# Altium project LimeSDR-X3_1v2.PrjPcb (part 16 of 16)
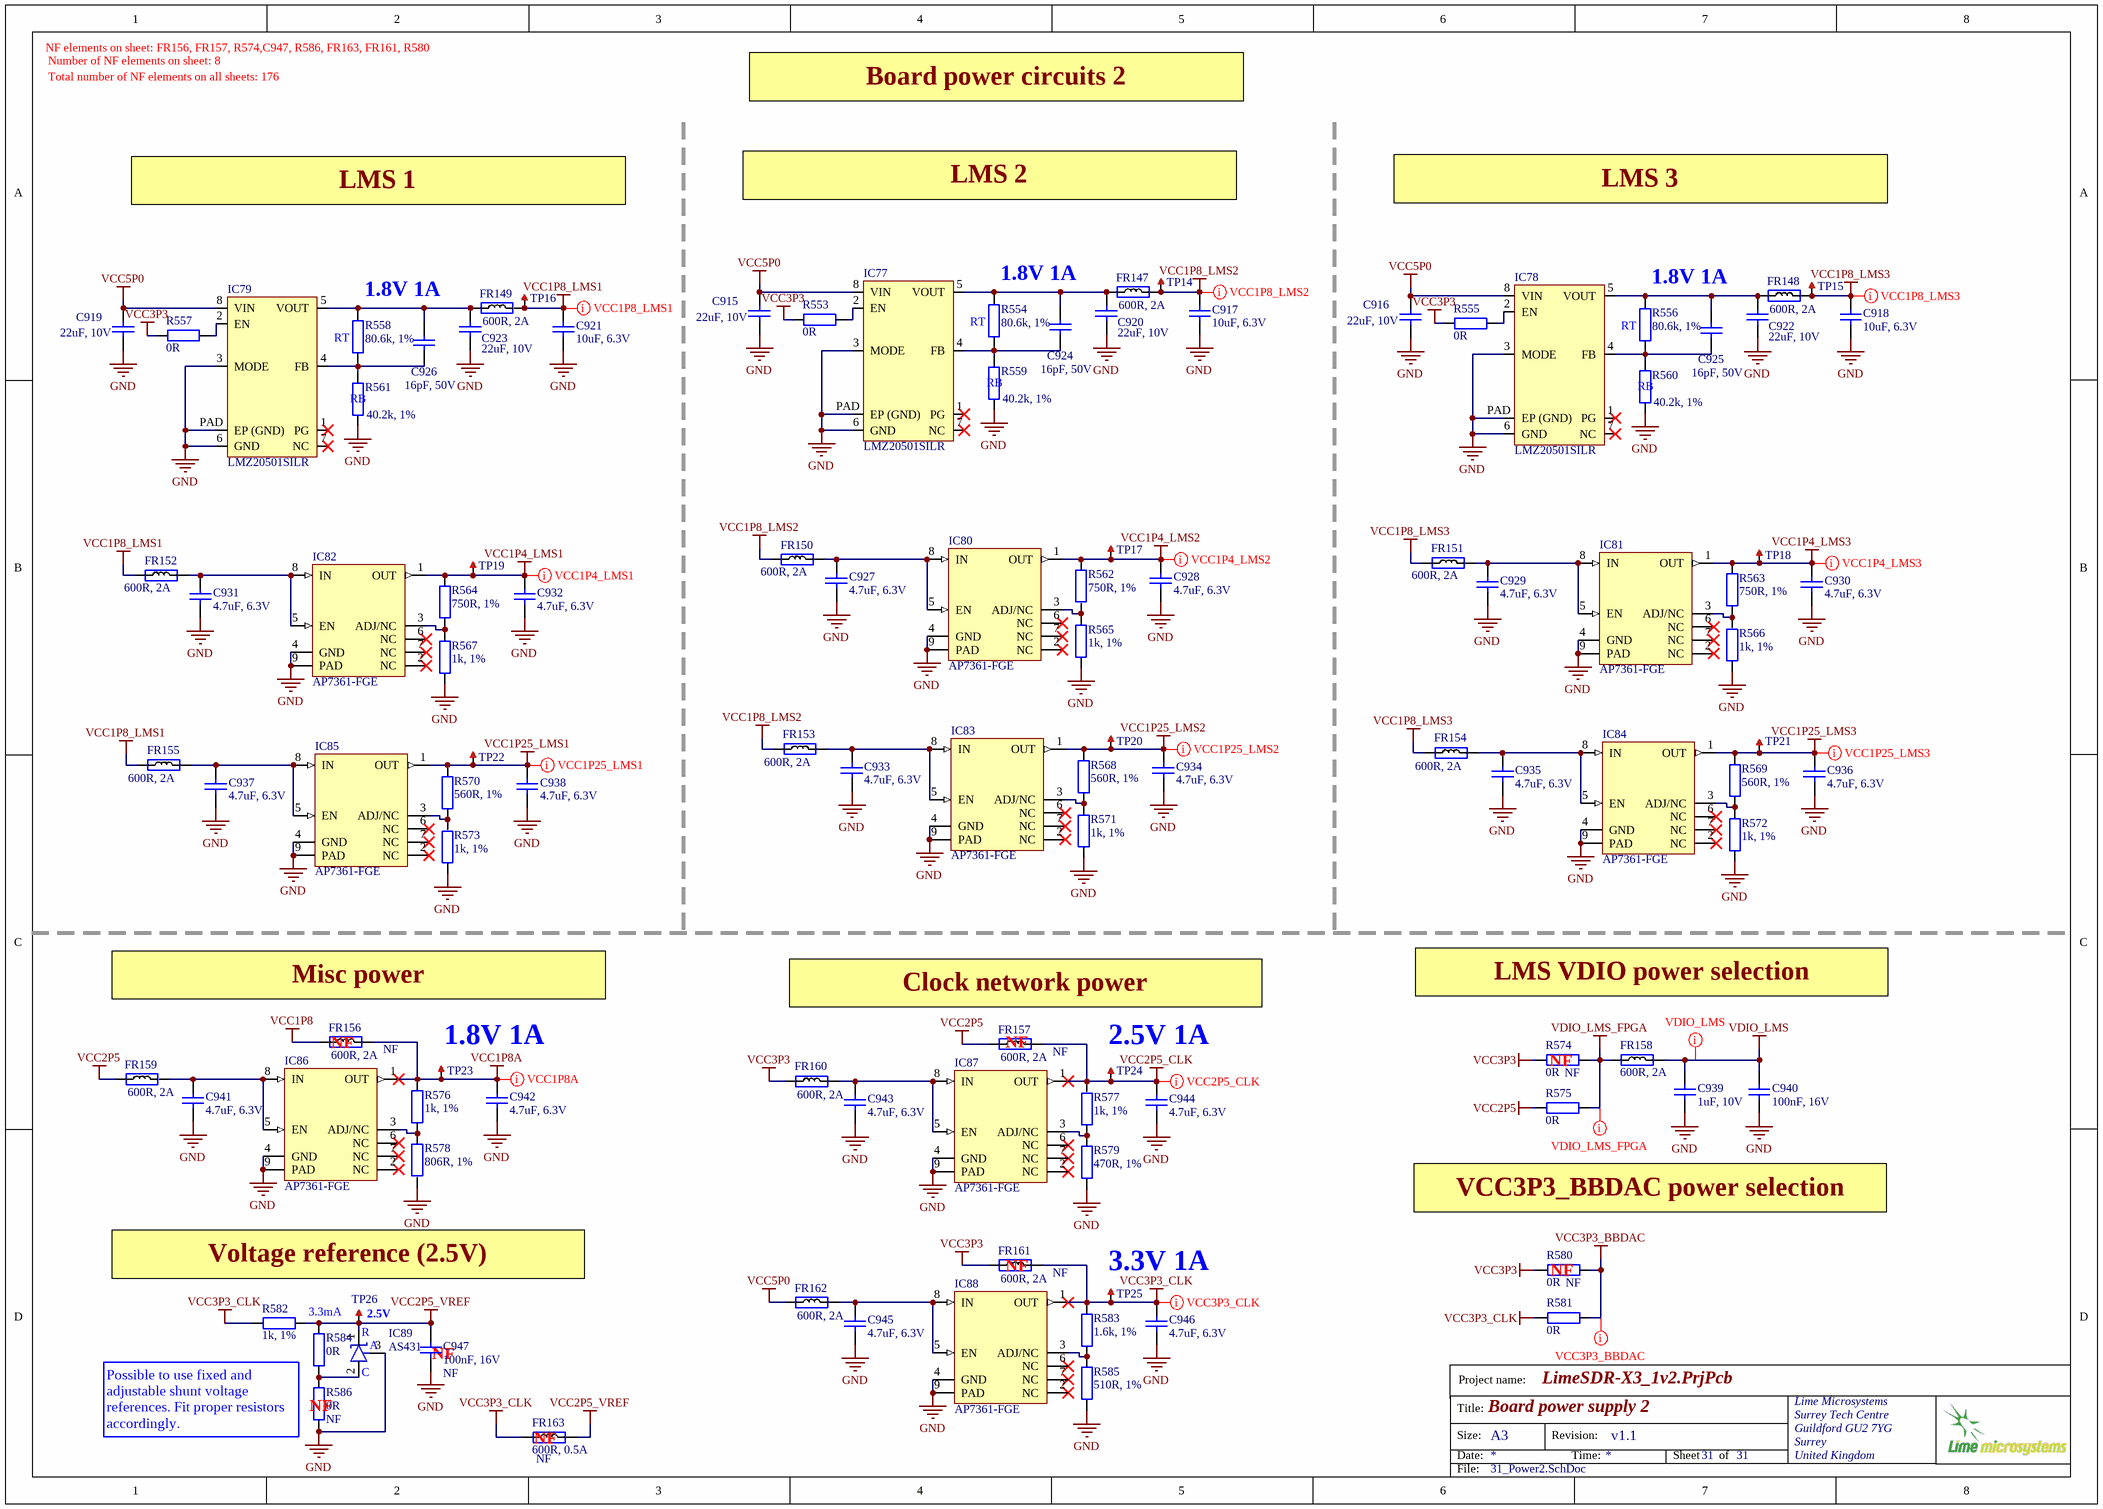
[diagram p19: 31_Power2.SchDoc]

## Nets that join several sheets
FPGA_MGTAVTT: 19_FPGA_misc (R163.2 R166.2), 20_FPGA_Power (26 pins)
GND: 07_LMS3_Misc (11 pins), 08_LMS1_RF (76 pins), 10_LMS3_RF (57 pins), 11_LMS1_Power (84 pins), 12_LMS2_Power (84 pins), 14_LMS1_RF_PA (92 pins), 15_LMS2_RF1_Misc (69 pins), 16_LMS2_RF2_Misc (69 pins), 17_FPGA_B12_B13_B14_B15 (IC39.L19 IC39.V24 IC39.W18), 19_FPGA_misc (53 pins), 20_FPGA_Power (244 pins), 21_Peripherals (52 pins), 22_LMS2_TX_BB_DACs (86 pins), 23_LMS2_RX1_BB_ADC (44 pins), 26_LMS3_RX2_BB_ADC (44 pins), 28_Clocks1 (76 pins), 29_Clocks2 (76 pins), 31_Power2 (71 pins)
GND_ADC: 19_FPGA_misc (IC39.N11 IC39.P11 IC39.P12), 20_FPGA_Power (C500.1 C501.2 FR103.2 IC39.M11)
VCC1P4_LMS1: 11_LMS1_Power (7 pins), 31_Power2 (C932.2 IC82.1 R564.1 TP19.1)
VCC1P4_LMS2: 12_LMS2_Power (7 pins), 31_Power2 (C928.2 IC80.1 R562.1 TP17.1)
VCC1P8: 20_FPGA_Power (14 pins), 29_Clocks2 (R484.2), 31_Power2 (FR156.1)
VCC1P8_LMS1: 08_LMS1_RF (24 pins), 11_LMS1_Power (11 pins), 31_Power2 (5 pins)
VCC1P8_LMS2: 12_LMS2_Power (11 pins), 31_Power2 (5 pins)
VCC1P8_LMS3: 10_LMS3_RF (18 pins), 31_Power2 (5 pins)
VCC1P8A: 21_Peripherals (C516.1 IC47.6), 22_LMS2_TX_BB_DACs (8 pins), 23_LMS2_RX1_BB_ADC (FR116.1 FR117.1), 26_LMS3_RX2_BB_ADC (FR125.1 FR126.1), 29_Clocks2 (R483.1), 31_Power2 (5 pins)
VCC1P25_LMS1: 11_LMS1_Power (18 pins), 31_Power2 (C938.2 IC85.1 R570.2 TP22.1)
VCC1P25_LMS2: 12_LMS2_Power (18 pins), 31_Power2 (C934.2 IC83.1 R568.2 TP20.1)
VCC2P5: 20_FPGA_Power (84 pins), 21_Peripherals (7 pins), 28_Clocks1 (R438.2), 31_Power2 (FR157.1 FR159.1 R575.2)
VCC2P5_CLK: 28_Clocks1 (R436.1 R467.2), 29_Clocks2 (26 pins), 31_Power2 (5 pins)
VCC2P5_VREF: 14_LMS1_RF_PA (R115.2 R130.2), 28_Clocks1 (R463.1), 31_Power2 (6 pins)
VCC3P3: 19_FPGA_misc (18 pins), 20_FPGA_Power (20 pins), 21_Peripherals (17 pins), 23_LMS2_RX1_BB_ADC (R303.2), 26_LMS3_RX2_BB_ADC (R387.2), 29_Clocks2 (C831.2 IC68.1), 31_Power2 (7 pins)
VCC3P3_BBDAC: 22_LMS2_TX_BB_DACs (12 pins), 31_Power2 (R580.1 R581.1)
VCC3P3_CLK: 21_Peripherals (FR104.1), 28_Clocks1 (11 pins), 29_Clocks2 (6 pins), 31_Power2 (8 pins)
VCC3P3_RF: 08_LMS1_RF (8 pins), 10_LMS3_RF (C80.2 C81.2 IC11.12 IC12.12), 14_LMS1_RF_PA (R116.2 R131.2), 15_LMS2_RF1_Misc (8 pins), 16_LMS2_RF2_Misc (8 pins)
VCC5P0: 21_Peripherals (R219.1 R224.2 R241.1), 23_LMS2_RX1_BB_ADC (R304.2), 26_LMS3_RX2_BB_ADC (R388.2), 29_Clocks2 (R488.1), 31_Power2 (7 pins)
VCC5P0_RF1: 14_LMS1_RF_PA (8 pins), 15_LMS2_RF1_Misc (R146.1)
VDIO_LMS: 07_LMS3_Misc (9 pins), 11_LMS1_Power (6 pins), 12_LMS2_Power (6 pins), 31_Power2 (C939.2 C940.1 FR158.2)
VDIO_LMS_FPGA: 20_FPGA_Power (14 pins), 31_Power2 (FR158.1 R574.1 R575.1)
ADF_MUXOUT: 17_FPGA_B12_B13_B14_B15 (IC39.M19), 28_Clocks1 (IC64.15 R454.1)
BOM_VER0: 18_FPGA_B16_B33_B34_B35 (IC39.K2), 19_FPGA_misc (R194.1)
BOM_VER1: 17_FPGA_B12_B13_B14_B15 (IC39.Y23), 19_FPGA_misc (R195.1)
BOM_VER2: 17_FPGA_B12_B13_B14_B15 (IC39.W24), 19_FPGA_misc (R196.1)
BOM_VER3: 18_FPGA_B16_B33_B34_B35 (IC39.N8), 19_FPGA_misc (R197.1)
CDCM_LMS2_BB_DAC1_REFC_N: 18_FPGA_B16_B33_B34_B35 (IC39.N2), 29_Clocks2 (IC67.15)
CDCM_LMS2_BB_DAC1_REFC_P: 18_FPGA_B16_B33_B34_B35 (IC39.N3), 29_Clocks2 (IC67.14)
CDCM_LMS2_BB_DAC2_REFC_N: 18_FPGA_B16_B33_B34_B35 (IC39.F5), 29_Clocks2 (IC67.16)
CDCM_LMS2_BB_DAC2_REFC_P: 18_FPGA_B16_B33_B34_B35 (IC39.G5), 29_Clocks2 (IC67.17)
CDCM_PRI_REF: 28_Clocks1 (IC62.8), 29_Clocks2 (IC67.8)
CDCM_RESET_N: 17_FPGA_B12_B13_B14_B15 (IC39.AC18), 29_Clocks2 (C806.2 IC67.44 R482.1)
CDCM_STATUS0: 17_FPGA_B12_B13_B14_B15 (IC39.AB16), 29_Clocks2 (IC67.46)
CDCM_STATUS1: 17_FPGA_B12_B13_B14_B15 (IC39.AC16), 29_Clocks2 (IC67.45)
CDCM_SYNCN: 17_FPGA_B12_B13_B14_B15 (IC39.AA15), 29_Clocks2 (IC67.42)
CLK100_FPGA_N: 17_FPGA_B12_B13_B14_B15 (IC39.V21), 29_Clocks2 (XO8.5)
CLK100_FPGA_P: 17_FPGA_B12_B13_B14_B15 (IC39.U21), 29_Clocks2 (XO8.4)
EXT_CLK_IN_N: 28_Clocks1 (R428.2 R431.2), 29_Clocks2 (J30.3)
EXT_CLK_IN_P: 28_Clocks1 (R424.2), 29_Clocks2 (J30.2 R487.2)
EXT_CLK_OUT: 28_Clocks1 (IC62.18), 29_Clocks2 (R495.2 R497.2)
EXT_PPS_IN: 17_FPGA_B12_B13_B14_B15 (IC39.N21), 29_Clocks2 (J30.5)
EXT_PPS_OUT: 17_FPGA_B12_B13_B14_B15 (IC39.T22), 29_Clocks2 (J31.5)
EXT_SYNC_IN: 17_FPGA_B12_B13_B14_B15 (IC39.P20), 29_Clocks2 (J30.6)
EXT_SYNC_OUT: 17_FPGA_B12_B13_B14_B15 (IC39.M25), 29_Clocks2 (J31.6)
FAN_CTRL: 18_FPGA_B16_B33_B34_B35 (IC39.U4), 21_Peripherals (R235.2 R236.1 VT2.G)
FPGA_CFG_CS: 17_FPGA_B12_B13_B14_B15 (IC39.P18), 19_FPGA_misc (IC40.1 IC41.7 R193.2)
FPGA_CFG_D00: 17_FPGA_B12_B13_B14_B15 (IC39.R14), 19_FPGA_misc (R185.2)
FPGA_CFG_D01: 17_FPGA_B12_B13_B14_B15 (IC39.R15), 19_FPGA_misc (R187.2)
FPGA_CFG_D02: 17_FPGA_B12_B13_B14_B15 (IC39.P14), 19_FPGA_misc (R189.2)
FPGA_CFG_D03: 17_FPGA_B12_B13_B14_B15 (IC39.N14), 19_FPGA_misc (R191.2)
FPGA_I2C_SCL: 17_FPGA_B12_B13_B14_B15 (IC39.N16), 21_Peripherals (5 pins)
FPGA_I2C_SDA: 17_FPGA_B12_B13_B14_B15 (IC39.N17), 21_Peripherals (5 pins)
FPGA_LED1_G: 17_FPGA_B12_B13_B14_B15 (IC39.T20), 21_Peripherals (R207.2)
FPGA_LED1_R: 17_FPGA_B12_B13_B14_B15 (IC39.U17), 21_Peripherals (R212.2)
FPGA_LED2_G: 17_FPGA_B12_B13_B14_B15 (IC39.U16), 21_Peripherals (R217.2)
FPGA_LED2_R: 17_FPGA_B12_B13_B14_B15 (IC39.V17), 21_Peripherals (R220.2)
FPGA_LED3_G: 17_FPGA_B12_B13_B14_B15 (IC39.U15), 21_Peripherals (R221.2)
FPGA_LED3_R: 17_FPGA_B12_B13_B14_B15 (IC39.V16), 21_Peripherals (R222.2)
FPGA_LED4_G: 17_FPGA_B12_B13_B14_B15 (IC39.U14), 21_Peripherals (R226.2)
FPGA_LED4_R: 17_FPGA_B12_B13_B14_B15 (IC39.V14), 21_Peripherals (R229.2)
FPGA_LMS2_BB_ADC1_RESET: 18_FPGA_B16_B33_B34_B35 (IC39.D23), 23_LMS2_RX1_BB_ADC (IC50.12)
FPGA_LMS2_BB_DAC1_CLK_N: 18_FPGA_B16_B33_B34_B35 (IC39.L2), 29_Clocks2 (R490.1)
FPGA_LMS2_BB_DAC1_CLK_P: 18_FPGA_B16_B33_B34_B35 (IC39.M2), 29_Clocks2 (R486.1)
FPGA_LMS2_BB_DAC2_CLK_N: 18_FPGA_B16_B33_B34_B35 (IC39.D5), 29_Clocks2 (R502.1)
FPGA_LMS2_BB_DAC2_CLK_P: 18_FPGA_B16_B33_B34_B35 (IC39.E5), 29_Clocks2 (R494.1)
FPGA_LMS3_BB_ADC2_RESET: 18_FPGA_B16_B33_B34_B35 (IC39.D20), 26_LMS3_RX2_BB_ADC (IC56.12)
FPGA_SPI0_LMS3_MISO: 07_LMS3_Misc (R68.2), 18_FPGA_B16_B33_B34_B35 (IC39.AD3)
FPGA_SPI0_LMS3_SS: 07_LMS3_Misc (R69.2), 18_FPGA_B16_B33_B34_B35 (IC39.AC2)
FPGA_SPI0_MOSI: 07_LMS3_Misc (R67.2), 18_FPGA_B16_B33_B34_B35 (IC39.Y5)
FPGA_SPI0_SCLK: 07_LMS3_Misc (R66.2), 18_FPGA_B16_B33_B34_B35 (IC39.Y6)
FPGA_SPI1_CDCM_SS: 17_FPGA_B12_B13_B14_B15 (IC39.AB22), 29_Clocks2 (IC67.4)
FPGA_SPI1_LMS2_BB_ADC1_SS: 18_FPGA_B16_B33_B34_B35 (IC39.C22), 23_LMS2_RX1_BB_ADC (IC50.15)
FPGA_SPI1_LMS3_BB_ADC2_SS: 18_FPGA_B16_B33_B34_B35 (IC39.E20), 26_LMS3_RX2_BB_ADC (IC56.15)
FPGA_SPI1_MISO: 17_FPGA_B12_B13_B14_B15 (IC39.L14), 29_Clocks2 (IC67.3)
FPGA_SPI1_MISO_BB_ADC: 18_FPGA_B16_B33_B34_B35 (IC39.E22), 21_Peripherals (IC47.3 R248.2)
FPGA_SPI1_MISO_BB_ADC_LS: 21_Peripherals (IC47.4 R247.2 R248.1), 23_LMS2_RX1_BB_ADC (IC50.64), 26_LMS3_RX2_BB_ADC (IC56.64)
FPGA_SPI1_MOSI: 17_FPGA_B12_B13_B14_B15 (IC39.M14), 23_LMS2_RX1_BB_ADC (IC50.14), 26_LMS3_RX2_BB_ADC (IC56.14), 29_Clocks2 (IC67.2)
FPGA_SPI1_SCLK: 17_FPGA_B12_B13_B14_B15 (IC39.M16), 23_LMS2_RX1_BB_ADC (IC50.13), 26_LMS3_RX2_BB_ADC (IC56.13), 29_Clocks2 (IC67.5)
FPGA_SPI2_ADF_SS: 18_FPGA_B16_B33_B34_B35 (IC39.J5), 28_Clocks1 (R459.1)
FPGA_SPI2_LMS1_TX1DAC_SS: 14_LMS1_RF_PA (R123.2), 17_FPGA_B12_B13_B14_B15 (IC39.AA17)
FPGA_SPI2_LMS1_TX2DAC_SS: 14_LMS1_RF_PA (R138.2), 17_FPGA_B12_B13_B14_B15 (IC39.AB17)
FPGA_SPI2_MOSI: 14_LMS1_RF_PA (R125.2 R140.2), 18_FPGA_B16_B33_B34_B35 (IC39.B2), 28_Clocks1 (R458.1 R465.2)
FPGA_SPI2_SCLK: 14_LMS1_RF_PA (R124.2 R139.2), 18_FPGA_B16_B33_B34_B35 (IC39.C2), 28_Clocks1 (R457.1 R464.2)
FPGA_SPI2_XO_DAC_SS: 18_FPGA_B16_B33_B34_B35 (IC39.J6), 28_Clocks1 (R462.2)
FPGA_SW0: 18_FPGA_B16_B33_B34_B35 (IC39.K5), 21_Peripherals (R205.2 SW1.2)
FPGA_SW1: 18_FPGA_B16_B33_B34_B35 (IC39.L5), 21_Peripherals (R204.2 SW1.4)
FPGA_SW2: 18_FPGA_B16_B33_B34_B35 (IC39.G1), 21_Peripherals (R203.2 SW1.6)
FPGA_SW3: 18_FPGA_B16_B33_B34_B35 (IC39.G2), 21_Peripherals (R202.2 SW1.8)
GNSS_TPULSE: 17_FPGA_B12_B13_B14_B15 (IC39.L20), 21_Peripherals (IC46.3)
GNSS_UART_RX: 17_FPGA_B12_B13_B14_B15 (IC39.L25), 21_Peripherals (IC46.21)
GNSS_UART_TX: 17_FPGA_B12_B13_B14_B15 (IC39.L24), 21_Peripherals (IC46.20)
LM75_OS: 17_FPGA_B12_B13_B14_B15 (IC39.U24), 21_Peripherals (IC42.3 R206.1 R235.1)
LMK1_CLK1: 17_FPGA_B12_B13_B14_B15 (IC39.W21), 28_Clocks1 (IC62.1)
LMK1_CLK2: 18_FPGA_B16_B33_B34_B35 (IC39.R3), 28_Clocks1 (IC62.3)
LMK1_SEL0: 17_FPGA_B12_B13_B14_B15 (IC39.K15), 28_Clocks1 (R427.1)
LMK2_CLK: 17_FPGA_B12_B13_B14_B15 (IC39.M21), 29_Clocks2 (IC68.3)
LMK2_CLKIN0: 28_Clocks1 (IC62.5), 29_Clocks2 (C791.2)
LMK2_CLKIN1: 18_FPGA_B16_B33_B34_B35 (IC39.P4), 29_Clocks2 (C795.2)
LMK2_SEL0: 17_FPGA_B12_B13_B14_B15 (IC39.H21), 29_Clocks2 (R477.1)
LMS1_TX1_EN: 14_LMS1_RF_PA (IC13.3), 17_FPGA_B12_B13_B14_B15 (IC39.J23)
LMS1_TX1_OUT: 08_LMS1_RF (C31.2), 14_LMS1_RF_PA (IC14.3)
LMS1_TX2_EN: 14_LMS1_RF_PA (IC18.3), 17_FPGA_B12_B13_B14_B15 (IC39.H23)
LMS1_TX2_OUT: 08_LMS1_RF (C37.2), 14_LMS1_RF_PA (IC19.3)
LMS2_BB_ADC1_CLK_N: 23_LMS2_RX1_BB_ADC (C582.2 R278.1), 29_Clocks2 (IC67.25)
LMS2_BB_ADC1_CLK_P: 23_LMS2_RX1_BB_ADC (C581.2 R278.2), 29_Clocks2 (IC67.26)
LMS2_BB_ADC1_CLKOUT_N: 18_FPGA_B16_B33_B34_B35 (IC39.C18), 23_LMS2_RX1_BB_ADC (IC50.56)
LMS2_BB_ADC1_CLKOUT_P: 18_FPGA_B16_B33_B34_B35 (IC39.D18), 23_LMS2_RX1_BB_ADC (IC50.57)
LMS2_BB_ADC1_DA0_N: 18_FPGA_B16_B33_B34_B35 (IC39.A20), 23_LMS2_RX1_BB_ADC (IC50.40)
LMS2_BB_ADC1_DA0_P: 18_FPGA_B16_B33_B34_B35 (IC39.B20), 23_LMS2_RX1_BB_ADC (IC50.41)
LMS2_BB_ADC1_DA1_N: 18_FPGA_B16_B33_B34_B35 (IC39.A18), 23_LMS2_RX1_BB_ADC (IC50.42)
LMS2_BB_ADC1_DA1_P: 18_FPGA_B16_B33_B34_B35 (IC39.A17), 23_LMS2_RX1_BB_ADC (IC50.43)
LMS2_BB_ADC1_DA2_N: 18_FPGA_B16_B33_B34_B35 (IC39.F17), 23_LMS2_RX1_BB_ADC (IC50.44)
LMS2_BB_ADC1_DA2_P: 18_FPGA_B16_B33_B34_B35 (IC39.G17), 23_LMS2_RX1_BB_ADC (IC50.45)
LMS2_BB_ADC1_DA3_N: 18_FPGA_B16_B33_B34_B35 (IC39.A19), 23_LMS2_RX1_BB_ADC (IC50.46)
LMS2_BB_ADC1_DA3_P: 18_FPGA_B16_B33_B34_B35 (IC39.B19), 23_LMS2_RX1_BB_ADC (IC50.47)
LMS2_BB_ADC1_DA4_N: 18_FPGA_B16_B33_B34_B35 (IC39.B17), 23_LMS2_RX1_BB_ADC (IC50.50)
LMS2_BB_ADC1_DA4_P: 18_FPGA_B16_B33_B34_B35 (IC39.C17), 23_LMS2_RX1_BB_ADC (IC50.51)
LMS2_BB_ADC1_DA5_N: 18_FPGA_B16_B33_B34_B35 (IC39.D16), 23_LMS2_RX1_BB_ADC (IC50.52)
LMS2_BB_ADC1_DA5_P: 18_FPGA_B16_B33_B34_B35 (IC39.E16), 23_LMS2_RX1_BB_ADC (IC50.53)
LMS2_BB_ADC1_DA6_N: 18_FPGA_B16_B33_B34_B35 (IC39.A22), 23_LMS2_RX1_BB_ADC (IC50.54)
LMS2_BB_ADC1_DA6_P: 18_FPGA_B16_B33_B34_B35 (IC39.B22), 23_LMS2_RX1_BB_ADC (IC50.55)
LMS2_BB_ADC1_DB0_N: 18_FPGA_B16_B33_B34_B35 (IC39.A24), 23_LMS2_RX1_BB_ADC (IC50.60)
LMS2_BB_ADC1_DB0_P: 18_FPGA_B16_B33_B34_B35 (IC39.A23), 23_LMS2_RX1_BB_ADC (IC50.61)
LMS2_BB_ADC1_DB1_N: 18_FPGA_B16_B33_B34_B35 (IC39.B26), 23_LMS2_RX1_BB_ADC (IC50.62)
LMS2_BB_ADC1_DB1_P: 18_FPGA_B16_B33_B34_B35 (IC39.C26), 23_LMS2_RX1_BB_ADC (IC50.63)
LMS2_BB_ADC1_DB2_N: 18_FPGA_B16_B33_B34_B35 (IC39.F19), 23_LMS2_RX1_BB_ADC (IC50.2)
LMS2_BB_ADC1_DB2_P: 18_FPGA_B16_B33_B34_B35 (IC39.F18), 23_LMS2_RX1_BB_ADC (IC50.3)
LMS2_BB_ADC1_DB3_N: 18_FPGA_B16_B33_B34_B35 (IC39.B21), 23_LMS2_RX1_BB_ADC (IC50.4)
LMS2_BB_ADC1_DB3_P: 18_FPGA_B16_B33_B34_B35 (IC39.C21), 23_LMS2_RX1_BB_ADC (IC50.5)
LMS2_BB_ADC1_DB4_N: 18_FPGA_B16_B33_B34_B35 (IC39.D21), 23_LMS2_RX1_BB_ADC (IC50.6)
LMS2_BB_ADC1_DB4_P: 18_FPGA_B16_B33_B34_B35 (IC39.E21), 23_LMS2_RX1_BB_ADC (IC50.7)
LMS2_BB_ADC1_DB5_N: 18_FPGA_B16_B33_B34_B35 (IC39.B24), 23_LMS2_RX1_BB_ADC (IC50.8)
LMS2_BB_ADC1_DB5_P: 18_FPGA_B16_B33_B34_B35 (IC39.C24), 23_LMS2_RX1_BB_ADC (IC50.9)
LMS2_BB_ADC1_DB6_N: 18_FPGA_B16_B33_B34_B35 (IC39.A25), 23_LMS2_RX1_BB_ADC (IC50.10)
LMS2_BB_ADC1_DB6_P: 18_FPGA_B16_B33_B34_B35 (IC39.B25), 23_LMS2_RX1_BB_ADC (IC50.11)
LMS2_BB_DAC1_B0_N: 18_FPGA_B16_B33_B34_B35 (IC39.M1), 22_LMS2_TX_BB_DACs (IC48.9)
LMS2_BB_DAC1_B0_P: 18_FPGA_B16_B33_B34_B35 (IC39.N1), 22_LMS2_TX_BB_DACs (IC48.8)
LMS2_BB_DAC1_B1_N: 18_FPGA_B16_B33_B34_B35 (IC39.R6), 22_LMS2_TX_BB_DACs (IC48.7)
LMS2_BB_DAC1_B1_P: 18_FPGA_B16_B33_B34_B35 (IC39.R7), 22_LMS2_TX_BB_DACs (IC48.6)
LMS2_BB_DAC1_B2_N: 18_FPGA_B16_B33_B34_B35 (IC39.L7), 22_LMS2_TX_BB_DACs (IC48.5)
LMS2_BB_DAC1_B2_P: 18_FPGA_B16_B33_B34_B35 (IC39.M7), 22_LMS2_TX_BB_DACs (IC48.4)
LMS2_BB_DAC1_B3_N: 18_FPGA_B16_B33_B34_B35 (IC39.T7), 22_LMS2_TX_BB_DACs (IC48.3)
LMS2_BB_DAC1_B3_P: 18_FPGA_B16_B33_B34_B35 (IC39.T8), 22_LMS2_TX_BB_DACs (IC48.2)
LMS2_BB_DAC1_B4_N: 18_FPGA_B16_B33_B34_B35 (IC39.P8), 22_LMS2_TX_BB_DACs (IC48.1)
LMS2_BB_DAC1_B4_P: 18_FPGA_B16_B33_B34_B35 (IC39.R8), 22_LMS2_TX_BB_DACs (IC48.68)
LMS2_BB_DAC1_B5_N: 18_FPGA_B16_B33_B34_B35 (IC39.U5), 22_LMS2_TX_BB_DACs (IC48.67)
LMS2_BB_DAC1_B5_P: 18_FPGA_B16_B33_B34_B35 (IC39.U6), 22_LMS2_TX_BB_DACs (IC48.66)
LMS2_BB_DAC1_B6_N: 18_FPGA_B16_B33_B34_B35 (IC39.P5), 22_LMS2_TX_BB_DACs (IC48.65)
LMS2_BB_DAC1_B6_P: 18_FPGA_B16_B33_B34_B35 (IC39.P6), 22_LMS2_TX_BB_DACs (IC48.64)
LMS2_BB_DAC1_B7_N: 18_FPGA_B16_B33_B34_B35 (IC39.R5), 22_LMS2_TX_BB_DACs (IC48.63)
LMS2_BB_DAC1_B7_P: 18_FPGA_B16_B33_B34_B35 (IC39.T5), 22_LMS2_TX_BB_DACs (IC48.62)
LMS2_BB_DAC1_B8_N: 18_FPGA_B16_B33_B34_B35 (IC39.U1), 22_LMS2_TX_BB_DACs (IC48.60)
LMS2_BB_DAC1_B8_P: 18_FPGA_B16_B33_B34_B35 (IC39.U2), 22_LMS2_TX_BB_DACs (IC48.59)
LMS2_BB_DAC1_B9_N: 18_FPGA_B16_B33_B34_B35 (IC39.R2), 22_LMS2_TX_BB_DACs (IC48.58)
LMS2_BB_DAC1_B9_P: 18_FPGA_B16_B33_B34_B35 (IC39.T2), 22_LMS2_TX_BB_DACs (IC48.57)
LMS2_BB_DAC1_B10_N: 18_FPGA_B16_B33_B34_B35 (IC39.P1), 22_LMS2_TX_BB_DACs (IC48.56)
LMS2_BB_DAC1_B10_P: 18_FPGA_B16_B33_B34_B35 (IC39.R1), 22_LMS2_TX_BB_DACs (IC48.55)
LMS2_BB_DAC1_B11_N: 18_FPGA_B16_B33_B34_B35 (IC39.T3), 22_LMS2_TX_BB_DACs (IC48.54)
LMS2_BB_DAC1_B11_P: 18_FPGA_B16_B33_B34_B35 (IC39.T4), 22_LMS2_TX_BB_DACs (IC48.53)
LMS2_BB_DAC1_B12_N: 18_FPGA_B16_B33_B34_B35 (IC39.L4), 22_LMS2_TX_BB_DACs (IC48.52)
LMS2_BB_DAC1_B12_P: 18_FPGA_B16_B33_B34_B35 (IC39.M4), 22_LMS2_TX_BB_DACs (IC48.51)
LMS2_BB_DAC1_B13_N: 18_FPGA_B16_B33_B34_B35 (IC39.J3), 22_LMS2_TX_BB_DACs (IC48.50)
LMS2_BB_DAC1_B13_P: 18_FPGA_B16_B33_B34_B35 (IC39.K3), 22_LMS2_TX_BB_DACs (IC48.49)
LMS2_BB_DAC1_B14_N: 18_FPGA_B16_B33_B34_B35 (IC39.J1), 22_LMS2_TX_BB_DACs (IC48.48)
LMS2_BB_DAC1_B14_P: 18_FPGA_B16_B33_B34_B35 (IC39.K1), 22_LMS2_TX_BB_DACs (IC48.47)
LMS2_BB_DAC1_B15_N: 18_FPGA_B16_B33_B34_B35 (IC39.H1), 22_LMS2_TX_BB_DACs (IC48.46)
LMS2_BB_DAC1_B15_P: 18_FPGA_B16_B33_B34_B35 (IC39.H2), 22_LMS2_TX_BB_DACs (IC48.45)
LMS2_BB_DAC1_CLK_N: 22_LMS2_TX_BB_DACs (C526.2), 29_Clocks2 (R490.2 R491.2)
LMS2_BB_DAC1_CLK_P: 22_LMS2_TX_BB_DACs (C528.2), 29_Clocks2 (R486.2 R489.2)
LMS2_BB_DAC1_PD: 17_FPGA_B12_B13_B14_B15 (IC39.M26), 22_LMS2_TX_BB_DACs (IC48.40)
LMS2_BB_DAC1_SELIQ_N: 18_FPGA_B16_B33_B34_B35 (IC39.M5), 22_LMS2_TX_BB_DACs (IC48.44)
LMS2_BB_DAC1_SELIQ_P: 18_FPGA_B16_B33_B34_B35 (IC39.M6), 22_LMS2_TX_BB_DACs (IC48.43)
LMS2_BB_DAC2_B0_N: 18_FPGA_B16_B33_B34_B35 (IC39.D6), 22_LMS2_TX_BB_DACs (IC49.9)
LMS2_BB_DAC2_B0_P: 18_FPGA_B16_B33_B34_B35 (IC39.E6), 22_LMS2_TX_BB_DACs (IC49.8)
LMS2_BB_DAC2_B1_N: 18_FPGA_B16_B33_B34_B35 (IC39.G7), 22_LMS2_TX_BB_DACs (IC49.7)
LMS2_BB_DAC2_B1_P: 18_FPGA_B16_B33_B34_B35 (IC39.H7), 22_LMS2_TX_BB_DACs (IC49.6)
LMS2_BB_DAC2_B2_N: 18_FPGA_B16_B33_B34_B35 (IC39.E3), 22_LMS2_TX_BB_DACs (IC49.5)
LMS2_BB_DAC2_B2_P: 18_FPGA_B16_B33_B34_B35 (IC39.F3), 22_LMS2_TX_BB_DACs (IC49.4)
LMS2_BB_DAC2_B3_N: 18_FPGA_B16_B33_B34_B35 (IC39.K6), 22_LMS2_TX_BB_DACs (IC49.3)
LMS2_BB_DAC2_B3_P: 18_FPGA_B16_B33_B34_B35 (IC39.K7), 22_LMS2_TX_BB_DACs (IC49.2)
LMS2_BB_DAC2_B4_N: 18_FPGA_B16_B33_B34_B35 (IC39.H4), 22_LMS2_TX_BB_DACs (IC49.1)
LMS2_BB_DAC2_B4_P: 18_FPGA_B16_B33_B34_B35 (IC39.J4), 22_LMS2_TX_BB_DACs (IC49.68)
LMS2_BB_DAC2_B5_N: 18_FPGA_B16_B33_B34_B35 (IC39.E2), 22_LMS2_TX_BB_DACs (IC49.67)
LMS2_BB_DAC2_B5_P: 18_FPGA_B16_B33_B34_B35 (IC39.F2), 22_LMS2_TX_BB_DACs (IC49.66)
LMS2_BB_DAC2_B6_N: 18_FPGA_B16_B33_B34_B35 (IC39.D1), 22_LMS2_TX_BB_DACs (IC49.65)
LMS2_BB_DAC2_B6_P: 18_FPGA_B16_B33_B34_B35 (IC39.E1), 22_LMS2_TX_BB_DACs (IC49.64)
LMS2_BB_DAC2_B7_N: 18_FPGA_B16_B33_B34_B35 (IC39.B1), 22_LMS2_TX_BB_DACs (IC49.63)
LMS2_BB_DAC2_B7_P: 18_FPGA_B16_B33_B34_B35 (IC39.C1), 22_LMS2_TX_BB_DACs (IC49.62)
LMS2_BB_DAC2_B8_N: 18_FPGA_B16_B33_B34_B35 (IC39.C3), 22_LMS2_TX_BB_DACs (IC49.60)
LMS2_BB_DAC2_B8_P: 18_FPGA_B16_B33_B34_B35 (IC39.D3), 22_LMS2_TX_BB_DACs (IC49.59)
LMS2_BB_DAC2_B9_N: 18_FPGA_B16_B33_B34_B35 (IC39.A4), 22_LMS2_TX_BB_DACs (IC49.58)
LMS2_BB_DAC2_B9_P: 18_FPGA_B16_B33_B34_B35 (IC39.B4), 22_LMS2_TX_BB_DACs (IC49.57)
LMS2_BB_DAC2_B10_N: 18_FPGA_B16_B33_B34_B35 (IC39.A2), 22_LMS2_TX_BB_DACs (IC49.56)
LMS2_BB_DAC2_B10_P: 18_FPGA_B16_B33_B34_B35 (IC39.A3), 22_LMS2_TX_BB_DACs (IC49.55)
LMS2_BB_DAC2_B11_N: 18_FPGA_B16_B33_B34_B35 (IC39.A5), 22_LMS2_TX_BB_DACs (IC49.54)
LMS2_BB_DAC2_B11_P: 18_FPGA_B16_B33_B34_B35 (IC39.B5), 22_LMS2_TX_BB_DACs (IC49.53)
LMS2_BB_DAC2_B12_N: 18_FPGA_B16_B33_B34_B35 (IC39.G6), 22_LMS2_TX_BB_DACs (IC49.52)
LMS2_BB_DAC2_B12_P: 18_FPGA_B16_B33_B34_B35 (IC39.H6), 22_LMS2_TX_BB_DACs (IC49.51)
LMS2_BB_DAC2_B13_N: 18_FPGA_B16_B33_B34_B35 (IC39.F7), 22_LMS2_TX_BB_DACs (IC49.50)
LMS2_BB_DAC2_B13_P: 18_FPGA_B16_B33_B34_B35 (IC39.F8), 22_LMS2_TX_BB_DACs (IC49.49)
LMS2_BB_DAC2_B14_N: 18_FPGA_B16_B33_B34_B35 (IC39.G9), 22_LMS2_TX_BB_DACs (IC49.48)
LMS2_BB_DAC2_B14_P: 18_FPGA_B16_B33_B34_B35 (IC39.H9), 22_LMS2_TX_BB_DACs (IC49.47)
LMS2_BB_DAC2_B15_N: 18_FPGA_B16_B33_B34_B35 (IC39.G8), 22_LMS2_TX_BB_DACs (IC49.46)
LMS2_BB_DAC2_B15_P: 18_FPGA_B16_B33_B34_B35 (IC39.H8), 22_LMS2_TX_BB_DACs (IC49.45)
LMS2_BB_DAC2_CLK_N: 22_LMS2_TX_BB_DACs (C527.2), 29_Clocks2 (R502.2 R503.2)
LMS2_BB_DAC2_CLK_P: 22_LMS2_TX_BB_DACs (C529.2), 29_Clocks2 (R494.2 R498.2)
LMS2_BB_DAC2_PD: 17_FPGA_B12_B13_B14_B15 (IC39.N24), 22_LMS2_TX_BB_DACs (IC49.40)
LMS2_BB_DAC2_SELIQ_N: 18_FPGA_B16_B33_B34_B35 (IC39.K8), 22_LMS2_TX_BB_DACs (IC49.44)
LMS2_BB_DAC2_SELIQ_P: 18_FPGA_B16_B33_B34_B35 (IC39.L8), 22_LMS2_TX_BB_DACs (IC49.43)
LMS2_RX1_LNA_SD: 15_LMS2_RF1_Misc (IC29.6 R149.2), 17_FPGA_B12_B13_B14_B15 (IC39.AD23)
LMS2_RX2_LNA_SD: 16_LMS2_RF2_Misc (IC37.6 R160.2), 17_FPGA_B12_B13_B14_B15 (IC39.AD24)
LMS2_TX1_1_CPL_OUT: 10_LMS3_RF (C76.2), 15_LMS2_RF1_Misc (IC26.2)
LMS2_TX1_1_EN: 15_LMS2_RF1_Misc (IC27.3), 17_FPGA_B12_B13_B14_B15 (IC39.L15)
LMS2_TX2_1_CPL_OUT: 10_LMS3_RF (C77.2), 16_LMS2_RF2_Misc (IC34.2)
LMS2_TX2_1_EN: 16_LMS2_RF2_Misc (IC35.3), 18_FPGA_B16_B33_B34_B35 (IC39.H14)
LMS3_BB_ADC2_CLK_N: 26_LMS3_RX2_BB_ADC (C672.2 R362.1), 29_Clocks2 (IC67.36)
LMS3_BB_ADC2_CLK_P: 26_LMS3_RX2_BB_ADC (C671.2 R362.2), 29_Clocks2 (IC67.35)
LMS3_BB_ADC2_CLKOUT_N: 17_FPGA_B12_B13_B14_B15 (IC39.V22), 26_LMS3_RX2_BB_ADC (IC56.56)
LMS3_BB_ADC2_CLKOUT_P: 17_FPGA_B12_B13_B14_B15 (IC39.U22), 26_LMS3_RX2_BB_ADC (IC56.57)
LMS3_BB_ADC2_DA0_N: 17_FPGA_B12_B13_B14_B15 (IC39.T15), 26_LMS3_RX2_BB_ADC (IC56.40)
LMS3_BB_ADC2_DA0_P: 17_FPGA_B12_B13_B14_B15 (IC39.T14), 26_LMS3_RX2_BB_ADC (IC56.41)
LMS3_BB_ADC2_DA1_N: 17_FPGA_B12_B13_B14_B15 (IC39.T18), 26_LMS3_RX2_BB_ADC (IC56.42)
LMS3_BB_ADC2_DA1_P: 17_FPGA_B12_B13_B14_B15 (IC39.T17), 26_LMS3_RX2_BB_ADC (IC56.43)
LMS3_BB_ADC2_DA2_N: 17_FPGA_B12_B13_B14_B15 (IC39.W23), 26_LMS3_RX2_BB_ADC (IC56.44)
LMS3_BB_ADC2_DA2_P: 17_FPGA_B12_B13_B14_B15 (IC39.V23), 26_LMS3_RX2_BB_ADC (IC56.45)
LMS3_BB_ADC2_DA3_N: 17_FPGA_B12_B13_B14_B15 (IC39.U19), 26_LMS3_RX2_BB_ADC (IC56.46)
LMS3_BB_ADC2_DA3_P: 17_FPGA_B12_B13_B14_B15 (IC39.T19), 26_LMS3_RX2_BB_ADC (IC56.47)
LMS3_BB_ADC2_DA4_N: 17_FPGA_B12_B13_B14_B15 (IC39.AA23), 26_LMS3_RX2_BB_ADC (IC56.50)
LMS3_BB_ADC2_DA4_P: 17_FPGA_B12_B13_B14_B15 (IC39.AA22), 26_LMS3_RX2_BB_ADC (IC56.51)
LMS3_BB_ADC2_DA5_N: 17_FPGA_B12_B13_B14_B15 (IC39.U26), 26_LMS3_RX2_BB_ADC (IC56.52)
LMS3_BB_ADC2_DA5_P: 17_FPGA_B12_B13_B14_B15 (IC39.U25), 26_LMS3_RX2_BB_ADC (IC56.53)
LMS3_BB_ADC2_DA6_N: 17_FPGA_B12_B13_B14_B15 (IC39.W26), 26_LMS3_RX2_BB_ADC (IC56.54)
LMS3_BB_ADC2_DA6_P: 17_FPGA_B12_B13_B14_B15 (IC39.V26), 26_LMS3_RX2_BB_ADC (IC56.55)
LMS3_BB_ADC2_DB0_N: 17_FPGA_B12_B13_B14_B15 (IC39.AC26), 26_LMS3_RX2_BB_ADC (IC56.60)
LMS3_BB_ADC2_DB0_P: 17_FPGA_B12_B13_B14_B15 (IC39.AB26), 26_LMS3_RX2_BB_ADC (IC56.61)
LMS3_BB_ADC2_DB1_N: 17_FPGA_B12_B13_B14_B15 (IC39.AB25), 26_LMS3_RX2_BB_ADC (IC56.62)
LMS3_BB_ADC2_DB1_P: 17_FPGA_B12_B13_B14_B15 (IC39.AA24), 26_LMS3_RX2_BB_ADC (IC56.63)
LMS3_BB_ADC2_DB2_N: 17_FPGA_B12_B13_B14_B15 (IC39.Y20), 26_LMS3_RX2_BB_ADC (IC56.2)
LMS3_BB_ADC2_DB2_P: 17_FPGA_B12_B13_B14_B15 (IC39.W20), 26_LMS3_RX2_BB_ADC (IC56.3)
LMS3_BB_ADC2_DB3_N: 17_FPGA_B12_B13_B14_B15 (IC39.AC24), 26_LMS3_RX2_BB_ADC (IC56.4)
LMS3_BB_ADC2_DB3_P: 17_FPGA_B12_B13_B14_B15 (IC39.AB24), 26_LMS3_RX2_BB_ADC (IC56.5)
LMS3_BB_ADC2_DB4_N: 17_FPGA_B12_B13_B14_B15 (IC39.W19), 26_LMS3_RX2_BB_ADC (IC56.6)
LMS3_BB_ADC2_DB4_P: 17_FPGA_B12_B13_B14_B15 (IC39.V19), 26_LMS3_RX2_BB_ADC (IC56.7)
LMS3_BB_ADC2_DB5_N: 17_FPGA_B12_B13_B14_B15 (IC39.AA25), 26_LMS3_RX2_BB_ADC (IC56.8)
LMS3_BB_ADC2_DB5_P: 17_FPGA_B12_B13_B14_B15 (IC39.Y25), 26_LMS3_RX2_BB_ADC (IC56.9)
LMS3_BB_ADC2_DB6_N: 17_FPGA_B12_B13_B14_B15 (IC39.Y26), 26_LMS3_RX2_BB_ADC (IC56.10)
LMS3_BB_ADC2_DB6_P: 17_FPGA_B12_B13_B14_B15 (IC39.W25), 26_LMS3_RX2_BB_ADC (IC56.11)
LMS3_RESET: 07_LMS3_Misc (IC5.E27 R61.1), 18_FPGA_B16_B33_B34_B35 (IC39.W6)
LMS3_RX2_BB_I_N: 07_LMS3_Misc (IC5.AC3), 26_LMS3_RX2_BB_ADC (R361.2 R364.2)
LMS3_RX2_BB_I_P: 07_LMS3_Misc (IC5.AD2), 26_LMS3_RX2_BB_ADC (R364.1 R367.2)
LMS3_RX2_BB_Q_N: 07_LMS3_Misc (IC5.AB6), 26_LMS3_RX2_BB_ADC (R372.2 R374.2)
LMS3_RX2_BB_Q_P: 07_LMS3_Misc (IC5.AC5), 26_LMS3_RX2_BB_ADC (R374.1 R377.2)
LMS3_RXEN: 07_LMS3_Misc (IC5.V34 R63.2), 18_FPGA_B16_B33_B34_B35 (IC39.U7)
LMS3_RxPLL_CLK: 07_LMS3_Misc (IC5.AM24), 29_Clocks2 (C805.2 R480.1)
LMS3_TX1_1: 10_LMS3_RF (C64.1), 15_LMS2_RF1_Misc (R148.2 R151.2)
LMS3_TX2_1: 10_LMS3_RF (C63.1), 16_LMS2_RF2_Misc (R159.2 R162.2)
LMS3_TXEN: 07_LMS3_Misc (IC5.U29 R62.2), 18_FPGA_B16_B33_B34_B35 (IC39.Y7)
LMS3_TxPLL_CLK: 07_LMS3_Misc (IC5.E5), 29_Clocks2 (C804.2 R479.1)
PCIE_PERSTn: 17_FPGA_B12_B13_B14_B15 (IC39.R23), 19_FPGA_misc (P1.A11)
PCIE_SMCLK: 17_FPGA_B12_B13_B14_B15 (IC39.R22), 19_FPGA_misc (P1.B5)
PCIE_SMDAT: 17_FPGA_B12_B13_B14_B15 (IC39.T23), 19_FPGA_misc (P1.B6)
PCIE_WAKEn: 17_FPGA_B12_B13_B14_B15 (IC39.R18), 19_FPGA_misc (R175.1 R176.1)
PD_LMS2_BB_ADC1_DRV: 17_FPGA_B12_B13_B14_B15 (IC39.W14), 23_LMS2_RX1_BB_ADC (IC51.14 IC51.20 R287.1)
PD_LMS3_BB_ADC2_DRV: 17_FPGA_B12_B13_B14_B15 (IC39.AD18), 26_LMS3_RX2_BB_ADC (IC57.14 IC57.20 R371.1)
PMOD_A_PIN1: 17_FPGA_B12_B13_B14_B15 (IC39.R25), 21_Peripherals (R200.1)
PMOD_A_PIN2: 17_FPGA_B12_B13_B14_B15 (IC39.P23), 21_Peripherals (R208.1)
PMOD_A_PIN3: 17_FPGA_B12_B13_B14_B15 (IC39.P21), 21_Peripherals (R210.1)
PMOD_A_PIN4: 17_FPGA_B12_B13_B14_B15 (IC39.P19), 21_Peripherals (R214.1)
PMOD_A_PIN7: 17_FPGA_B12_B13_B14_B15 (IC39.R20), 21_Peripherals (R201.2)
PMOD_A_PIN8: 17_FPGA_B12_B13_B14_B15 (IC39.R21), 21_Peripherals (R209.2)
PMOD_A_PIN9: 17_FPGA_B12_B13_B14_B15 (IC39.P15), 21_Peripherals (R211.2)
PMOD_A_PIN10: 17_FPGA_B12_B13_B14_B15 (IC39.P16), 21_Peripherals (R215.2)
PMOD_B_PIN1: 17_FPGA_B12_B13_B14_B15 (IC39.L23), 21_Peripherals (R227.1)
PMOD_B_PIN2: 17_FPGA_B12_B13_B14_B15 (IC39.M24), 21_Peripherals (R230.1)
PMOD_B_PIN3: 17_FPGA_B12_B13_B14_B15 (IC39.M22), 21_Peripherals (R233.1)
PMOD_B_PIN4: 17_FPGA_B12_B13_B14_B15 (IC39.N22), 21_Peripherals (R237.1)
PMOD_B_PIN7: 17_FPGA_B12_B13_B14_B15 (IC39.N19), 21_Peripherals (R228.2)
PMOD_B_PIN8: 17_FPGA_B12_B13_B14_B15 (IC39.P24), 21_Peripherals (R231.2)
PMOD_B_PIN9: 17_FPGA_B12_B13_B14_B15 (IC39.P25), 21_Peripherals (R234.2)
PMOD_B_PIN10: 17_FPGA_B12_B13_B14_B15 (IC39.N23), 21_Peripherals (R238.2)
PTP_CLK1_OUT: 17_FPGA_B12_B13_B14_B15 (IC39.T25), 28_Clocks1 (R421.2 R461.2)
RFSW1_LMS3_RX1_V1: 10_LMS3_RF (C78.1 IC11.10), 18_FPGA_B16_B33_B34_B35 (IC39.E17)
RFSW1_LMS3_RX2_V1: 10_LMS3_RF (C79.1 IC12.10), 18_FPGA_B16_B33_B34_B35 (IC39.E18)
RFSW_LMS1_RX1_V1: 08_LMS1_RF (C34.1 IC8.10), 18_FPGA_B16_B33_B34_B35 (IC39.F15)
RFSW_LMS1_RX2_V1: 08_LMS1_RF (C40.1 IC10.10), 18_FPGA_B16_B33_B34_B35 (IC39.G15)
RFSW_LMS1_TX1_V1: 08_LMS1_RF (C33.1 IC7.10), 18_FPGA_B16_B33_B34_B35 (IC39.G19)
RFSW_LMS1_TX2_V1: 08_LMS1_RF (C39.1 IC9.10), 18_FPGA_B16_B33_B34_B35 (IC39.H16)
RFSW_LMS2_RX1C_V1: 15_LMS2_RF1_Misc (C326.1 IC28.10), 18_FPGA_B16_B33_B34_B35 (IC39.H15)
RFSW_LMS2_RX1IN_V1: 15_LMS2_RF1_Misc (C329.1 IC30.10), 18_FPGA_B16_B33_B34_B35 (IC39.D19)
RFSW_LMS2_RX2C_V1: 16_LMS2_RF2_Misc (C353.1 IC36.10), 17_FPGA_B12_B13_B14_B15 (IC39.J16)
RFSW_LMS2_RX2IN_V1: 16_LMS2_RF2_Misc (C356.1 IC38.10), 17_FPGA_B12_B13_B14_B15 (IC39.M15)
RFSW_LMS2_TRX1_V1: 15_LMS2_RF1_Misc (C313.1 IC23.10), 17_FPGA_B12_B13_B14_B15 (IC39.J14)
RFSW_LMS2_TRX1T_V1: 15_LMS2_RF1_Misc (C314.1 IC24.10), 17_FPGA_B12_B13_B14_B15 (IC39.J15)
RFSW_LMS2_TRX2_V1: 16_LMS2_RF2_Misc (C341.1 IC32.10), 18_FPGA_B16_B33_B34_B35 (IC39.H17)
RFSW_LMS2_TRX2T_V1: 16_LMS2_RF2_Misc (C340.1 IC31.10), 17_FPGA_B12_B13_B14_B15 (IC39.K18)
XO_VC_FPGA: 17_FPGA_B12_B13_B14_B15 (IC39.N26), 28_Clocks1 (R443.1)